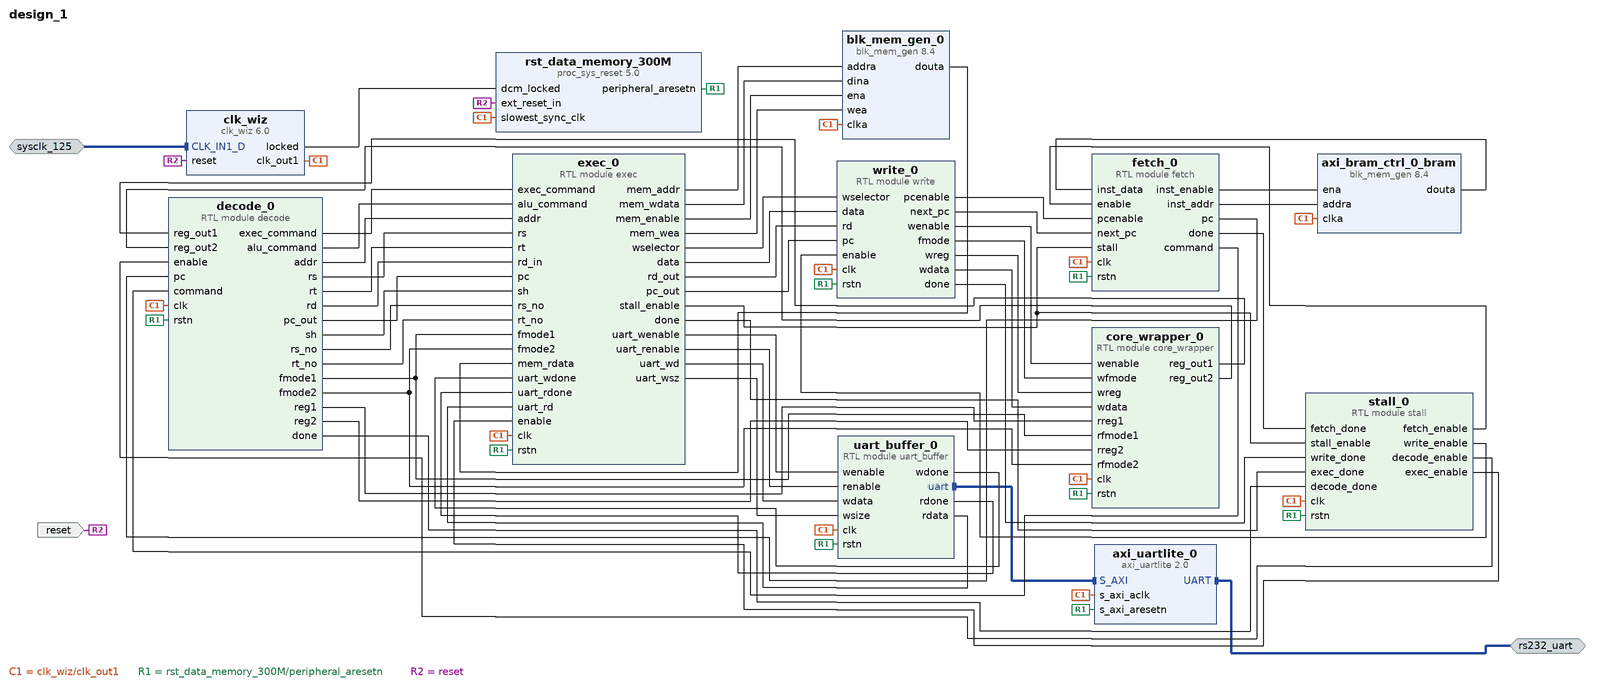
[diagram p0: block diagram of the top level]
# Vivado block design design_1, xcku040-ffva1156-2-e, Vivado 2018.3
create_bd_design design_1

create_bd_intf_port -mode Master -vlnv xilinx.com:interface:uart_rtl:1.0 rs232_uart
create_bd_intf_port -mode Slave -vlnv xilinx.com:interface:diff_clock_rtl:1.0 sysclk_125
set_property -dict {CONFIG.FREQ_HZ 125000000} [get_bd_intf_ports sysclk_125]
create_bd_port -dir I -type rst reset
set_property -dict {CONFIG.POLARITY ACTIVE_HIGH} [get_bd_ports reset]

create_bd_cell -type ip -vlnv xilinx.com:ip:blk_mem_gen:8.4 axi_bram_ctrl_0_bram
set_property -dict [list \
  CONFIG.Coe_File ../../../../../../../inst_memory.coe \
  CONFIG.Enable_32bit_Address false \
  CONFIG.Load_Init_File true \
  CONFIG.Memory_Type Single_Port_ROM \
  CONFIG.Port_A_Write_Rate 0 \
  CONFIG.Register_PortA_Output_of_Memory_Primitives true \
  CONFIG.Use_RSTA_Pin false \
  CONFIG.use_bram_block Stand_Alone \
] [get_bd_cells axi_bram_ctrl_0_bram]
create_bd_cell -type ip -vlnv xilinx.com:ip:axi_uartlite:2.0 axi_uartlite_0
set_property -dict [list \
  CONFIG.C_BAUDRATE 115200 \
  CONFIG.C_S_AXI_ACLK_FREQ_HZ 20000000 \
  CONFIG.C_S_AXI_ACLK_FREQ_HZ_d 20 \
  CONFIG.UARTLITE_BOARD_INTERFACE rs232_uart \
  CONFIG.USE_BOARD_FLOW true \
] [get_bd_cells axi_uartlite_0]
create_bd_cell -type ip -vlnv xilinx.com:ip:blk_mem_gen:8.4 blk_mem_gen_0
set_property -dict [list \
  CONFIG.Byte_Size 8 \
  CONFIG.Enable_32bit_Address false \
  CONFIG.Enable_A Use_ENA_Pin \
  CONFIG.Load_Init_File false \
  CONFIG.Read_Width_A 32 \
  CONFIG.Register_PortA_Output_of_Memory_Primitives true \
  CONFIG.Use_Byte_Write_Enable true \
  CONFIG.Use_RSTA_Pin false \
  CONFIG.Write_Width_A 32 \
  CONFIG.use_bram_block Stand_Alone \
] [get_bd_cells blk_mem_gen_0]
create_bd_cell -type ip -vlnv xilinx.com:ip:clk_wiz:6.0 clk_wiz
set_property -dict [list \
  CONFIG.CLKOUT1_JITTER 172.798 \
  CONFIG.CLKOUT1_PHASE_ERROR 96.948 \
  CONFIG.CLKOUT1_REQUESTED_OUT_FREQ 20 \
  CONFIG.CLK_IN1_BOARD_INTERFACE sysclk_125 \
  CONFIG.MMCM_CLKFBOUT_MULT_F 8.000 \
  CONFIG.MMCM_CLKIN2_PERIOD 10.000 \
  CONFIG.MMCM_CLKOUT0_DIVIDE_F 50.000 \
  CONFIG.MMCM_DIVCLK_DIVIDE 1 \
  CONFIG.RESET_BOARD_INTERFACE reset \
  CONFIG.USE_BOARD_FLOW true \
] [get_bd_cells clk_wiz]
create_bd_cell -type ip -vlnv xilinx.com:ip:proc_sys_reset:5.0 rst_data_memory_300M
set_property -dict {CONFIG.RESET_BOARD_INTERFACE reset CONFIG.USE_BOARD_FLOW true} [get_bd_cells rst_data_memory_300M]
create_bd_cell -type module -reference uart_buffer uart_buffer_0
create_bd_cell -type module -reference core_wrapper core_wrapper_0
create_bd_cell -type module -reference write write_0
create_bd_cell -type module -reference decode decode_0
create_bd_cell -type module -reference stall stall_0
create_bd_cell -type module -reference fetch fetch_0
create_bd_cell -type module -reference exec exec_0

# ---- connections ----

connect_bd_intf_net -intf_net sysclk_125_1 [get_bd_intf_ports sysclk_125] [get_bd_intf_pins clk_wiz/CLK_IN1_D]
connect_bd_intf_net [get_bd_intf_ports rs232_uart] [get_bd_intf_pins axi_uartlite_0/UART]
connect_bd_intf_net [get_bd_intf_pins uart_buffer_0/uart] [get_bd_intf_pins axi_uartlite_0/S_AXI]
connect_bd_net [get_bd_pins decode_0/exec_command] [get_bd_pins exec_0/exec_command]
connect_bd_net [get_bd_pins decode_0/alu_command] [get_bd_pins exec_0/alu_command]
connect_bd_net [get_bd_pins decode_0/addr] [get_bd_pins exec_0/addr]
connect_bd_net [get_bd_pins decode_0/rs] [get_bd_pins exec_0/rs]
connect_bd_net [get_bd_pins decode_0/rt] [get_bd_pins exec_0/rt]
connect_bd_net [get_bd_pins decode_0/rd] [get_bd_pins exec_0/rd_in]
connect_bd_net -net exec_0_wselector_out [get_bd_pins exec_0/wselector] [get_bd_pins write_0/wselector]
connect_bd_net -net exec_0_data_out [get_bd_pins exec_0/data] [get_bd_pins write_0/data]
connect_bd_net [get_bd_pins exec_0/rd_out] [get_bd_pins write_0/rd]
connect_bd_net [get_bd_pins core_wrapper_0/reg_out1] [get_bd_pins decode_0/reg_out1]
connect_bd_net [get_bd_pins core_wrapper_0/reg_out2] [get_bd_pins decode_0/reg_out2]
connect_bd_net [get_bd_pins decode_0/reg1] [get_bd_pins core_wrapper_0/rreg1]
connect_bd_net [get_bd_pins decode_0/reg2] [get_bd_pins core_wrapper_0/rreg2]
connect_bd_net [get_bd_pins write_0/wenable] [get_bd_pins core_wrapper_0/wenable]
connect_bd_net [get_bd_pins write_0/fmode] [get_bd_pins core_wrapper_0/wfmode]
connect_bd_net [get_bd_pins write_0/wreg] [get_bd_pins core_wrapper_0/wreg]
connect_bd_net [get_bd_pins write_0/wdata] [get_bd_pins core_wrapper_0/wdata]
connect_bd_net [get_bd_pins decode_0/pc_out] [get_bd_pins exec_0/pc]
connect_bd_net [get_bd_pins decode_0/sh] [get_bd_pins exec_0/sh]
connect_bd_net [get_bd_pins exec_0/pc_out] [get_bd_pins write_0/pc]
connect_bd_net -net write_0_uart_wenable [get_bd_pins exec_0/uart_wenable] [get_bd_pins uart_buffer_0/wenable]
connect_bd_net [get_bd_pins uart_buffer_0/wdone] [get_bd_pins exec_0/uart_wdone]
connect_bd_net -net data_memory_c0_ddr4_ui_clk [get_bd_pins clk_wiz/clk_out1] \
  [get_bd_pins axi_uartlite_0/s_axi_aclk] [get_bd_pins rst_data_memory_300M/slowest_sync_clk] [get_bd_pins uart_buffer_0/clk] \
  [get_bd_pins core_wrapper_0/clk] [get_bd_pins write_0/clk] [get_bd_pins decode_0/clk] \
  [get_bd_pins axi_bram_ctrl_0_bram/clka] [get_bd_pins blk_mem_gen_0/clka] [get_bd_pins stall_0/clk] \
  [get_bd_pins fetch_0/clk] [get_bd_pins exec_0/clk]
connect_bd_net [get_bd_pins rst_data_memory_300M/peripheral_aresetn] \
  [get_bd_pins axi_uartlite_0/s_axi_aresetn] [get_bd_pins uart_buffer_0/rstn] [get_bd_pins core_wrapper_0/rstn] \
  [get_bd_pins write_0/rstn] [get_bd_pins decode_0/rstn] [get_bd_pins stall_0/rstn] [get_bd_pins fetch_0/rstn] \
  [get_bd_pins exec_0/rstn]
connect_bd_net [get_bd_ports reset] [get_bd_pins clk_wiz/reset] [get_bd_pins rst_data_memory_300M/ext_reset_in]
connect_bd_net [get_bd_pins clk_wiz/locked] [get_bd_pins rst_data_memory_300M/dcm_locked]
connect_bd_net [get_bd_pins exec_0/uart_renable] [get_bd_pins uart_buffer_0/renable]
connect_bd_net [get_bd_pins uart_buffer_0/rdone] [get_bd_pins exec_0/uart_rdone]
connect_bd_net [get_bd_pins exec_0/uart_wd] [get_bd_pins uart_buffer_0/wdata]
connect_bd_net [get_bd_pins exec_0/uart_wsz] [get_bd_pins uart_buffer_0/wsize]
connect_bd_net [get_bd_pins uart_buffer_0/rdata] [get_bd_pins exec_0/uart_rd]
connect_bd_net -net stall_0_wire_enable [get_bd_pins stall_0/write_enable] [get_bd_pins write_0/enable]
connect_bd_net [get_bd_pins write_0/done] [get_bd_pins stall_0/write_done]
connect_bd_net [get_bd_pins stall_0/decode_enable] [get_bd_pins decode_0/enable]
connect_bd_net [get_bd_pins decode_0/done] [get_bd_pins stall_0/decode_done]
connect_bd_net [get_bd_pins stall_0/exec_enable] [get_bd_pins exec_0/enable]
connect_bd_net [get_bd_pins exec_0/done] [get_bd_pins stall_0/exec_done]
connect_bd_net [get_bd_pins decode_0/rs_no] [get_bd_pins exec_0/rs_no]
connect_bd_net [get_bd_pins decode_0/rt_no] [get_bd_pins exec_0/rt_no]
connect_bd_net -net write_0_stall_enable [get_bd_pins exec_0/stall_enable] [get_bd_pins stall_0/stall_enable] [get_bd_pins fetch_0/stall]
connect_bd_net [get_bd_pins fetch_0/pc] [get_bd_pins decode_0/pc]
connect_bd_net [get_bd_pins fetch_0/command] [get_bd_pins decode_0/command]
connect_bd_net [get_bd_pins fetch_0/done] [get_bd_pins stall_0/fetch_done]
connect_bd_net [get_bd_pins stall_0/fetch_enable] [get_bd_pins fetch_0/enable]
connect_bd_net [get_bd_pins write_0/pcenable] [get_bd_pins fetch_0/pcenable]
connect_bd_net [get_bd_pins write_0/next_pc] [get_bd_pins fetch_0/next_pc]
connect_bd_net [get_bd_pins decode_0/fmode1] [get_bd_pins core_wrapper_0/rfmode1] [get_bd_pins exec_0/fmode1]
connect_bd_net [get_bd_pins decode_0/fmode2] [get_bd_pins core_wrapper_0/rfmode2] [get_bd_pins exec_0/fmode2]
connect_bd_net [get_bd_pins axi_bram_ctrl_0_bram/douta] [get_bd_pins fetch_0/inst_data]
connect_bd_net [get_bd_pins fetch_0/inst_enable] [get_bd_pins axi_bram_ctrl_0_bram/ena]
connect_bd_net [get_bd_pins fetch_0/inst_addr] [get_bd_pins axi_bram_ctrl_0_bram/addra]
connect_bd_net [get_bd_pins exec_0/mem_addr] [get_bd_pins blk_mem_gen_0/addra]
connect_bd_net [get_bd_pins exec_0/mem_wdata] [get_bd_pins blk_mem_gen_0/dina]
connect_bd_net [get_bd_pins blk_mem_gen_0/douta] [get_bd_pins exec_0/mem_rdata]
connect_bd_net [get_bd_pins exec_0/mem_enable] [get_bd_pins blk_mem_gen_0/ena]
connect_bd_net [get_bd_pins exec_0/mem_wea] [get_bd_pins blk_mem_gen_0/wea]

# ---- address map ----
assign_bd_address -offset 0x40600000 -range 64K -target_address_space [get_bd_addr_spaces uart_buffer_0/uart] [get_bd_addr_segs axi_uartlite_0/S_AXI/Reg]

validate_bd_design
save_bd_design
